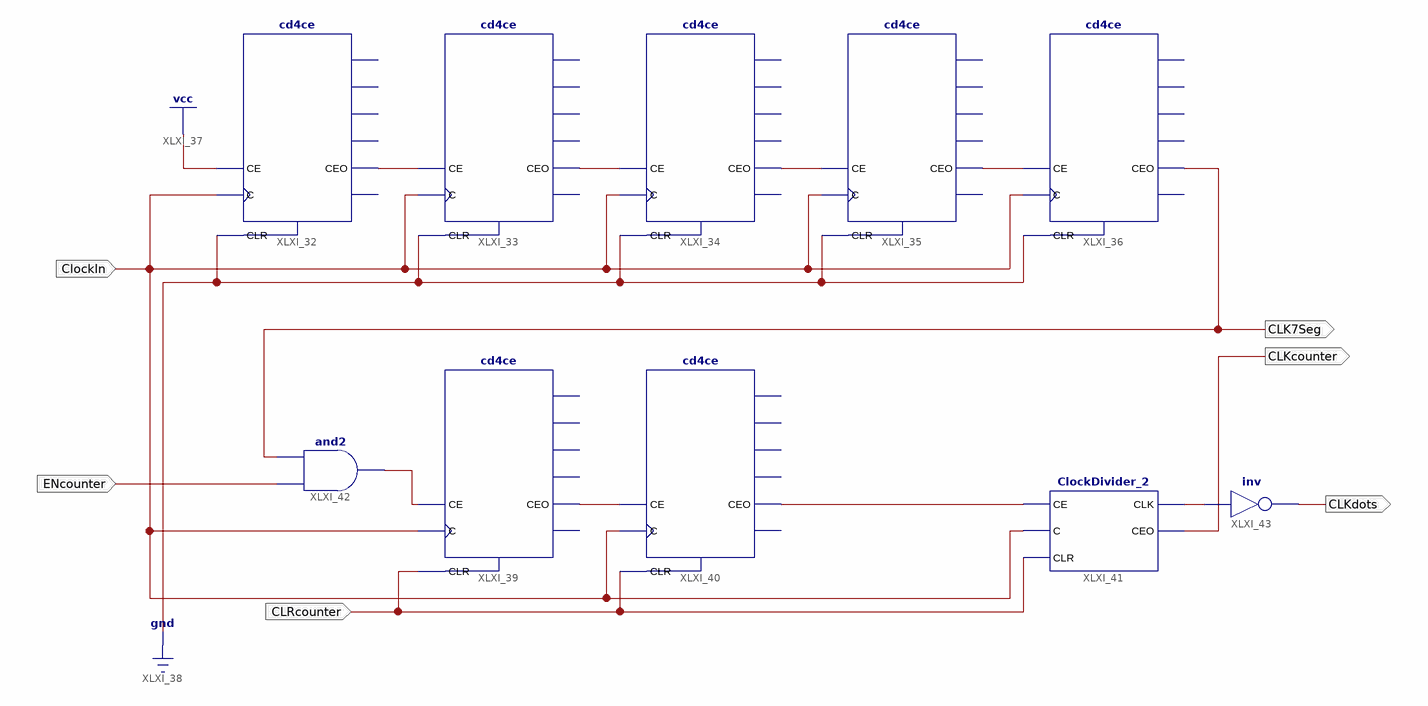
[diagram p0: schematic sheet 1]
// Xilinx ISE schematic ClockDivider.sch (spartan6) as structural Verilog: 10 symbols, 6 ports
module ClockDivider (
  input  ClockIn,
  input  ENcounter,
  input  CLRcounter,
  output CLK7Seg,
  output CLKcounter,
  output CLKdots
);

  wire XLXN_46, XLXN_47, XLXN_48, XLXN_50, XLXN_54, XLXN_59, XLXN_66, XLXN_70;

  cd4ce XLXI_32 (.C(ClockIn), .CE(1'b1), .CLR(1'b0), .CEO(XLXN_46));  // open: Q0, Q1, Q2, Q3, TC
  cd4ce XLXI_33 (.C(ClockIn), .CE(XLXN_46), .CLR(1'b0), .CEO(XLXN_47));  // open: Q0, Q1, Q2, Q3, TC
  cd4ce XLXI_34 (.C(ClockIn), .CE(XLXN_47), .CLR(1'b0), .CEO(XLXN_48));  // open: Q0, Q1, Q2, Q3, TC
  cd4ce XLXI_35 (.C(ClockIn), .CE(XLXN_48), .CLR(1'b0), .CEO(XLXN_50));  // open: Q0, Q1, Q2, Q3, TC
  cd4ce XLXI_36 (.C(ClockIn), .CE(XLXN_50), .CLR(1'b0), .CEO(CLK7Seg));  // open: Q0, Q1, Q2, Q3, TC
  cd4ce XLXI_39 (.C(ClockIn), .CE(XLXN_66), .CLR(CLRcounter), .CEO(XLXN_54));  // open: Q0, Q1, Q2, Q3, TC
  cd4ce XLXI_40 (.C(ClockIn), .CE(XLXN_54), .CLR(CLRcounter), .CEO(XLXN_59));  // open: Q0, Q1, Q2, Q3, TC
  ClockDivider_2 XLXI_41 (.C(ClockIn), .CE(XLXN_59), .CLK(XLXN_70), .CEO(CLKcounter), .CLR(CLRcounter));
  and XLXI_42 (XLXN_66, ENcounter, CLK7Seg);
  not XLXI_43 (CLKdots, XLXN_70);
endmodule
